# Altium schematic sheet Ideal_Diode_A.SchDoc
size A4; SheetNumber: 6; SheetTotal: 10
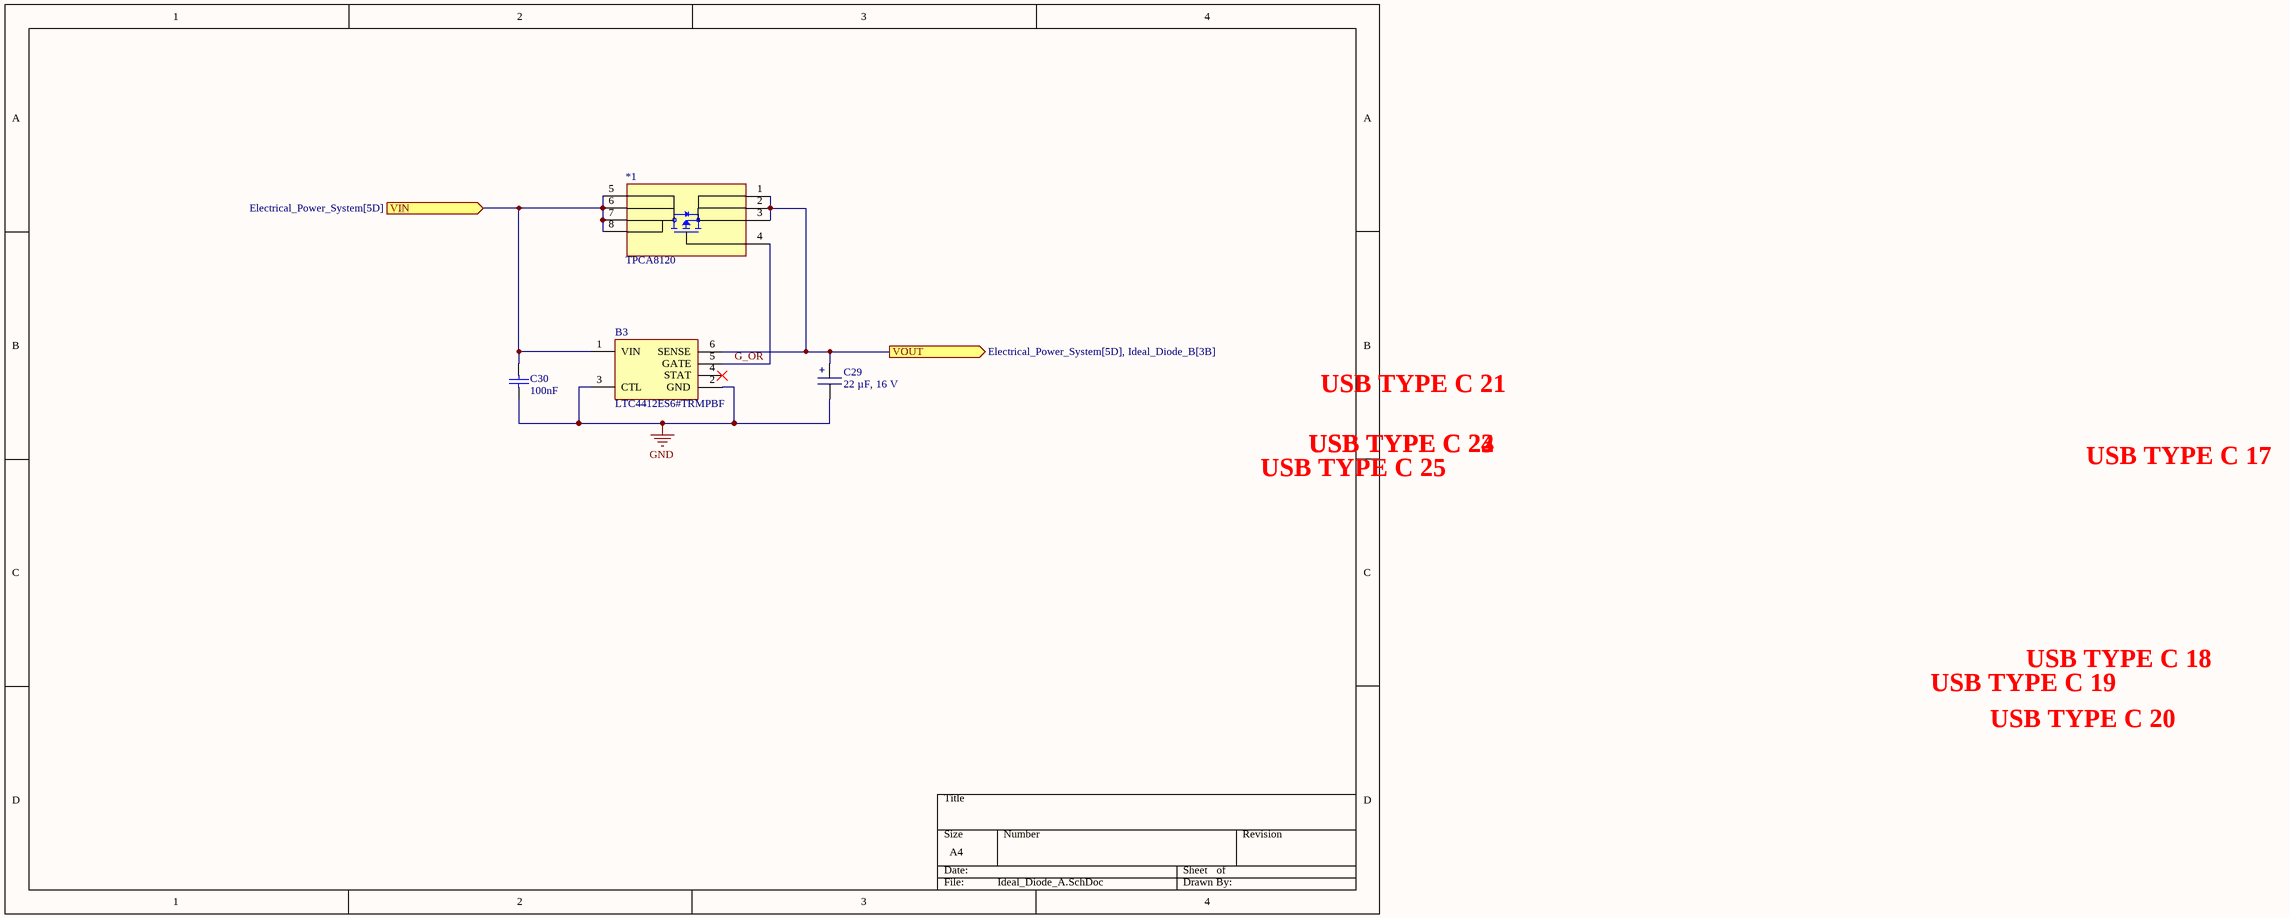
[diagram p0: Ideal_Diode_A.SchDoc]

## Parts
*1  TPCA8120  [TRANS_TPHR8504PL,L1Q]
B3  LTC4412ES6#TRMPBF  [SOT95P280X100-6N]
C29  22 µF, 16 V  [TANTALUM SMD C]
C30  value 100nF  [CAP-SM-0805]  (hidden comment: Cap Non-Pol SMD)

## Ports
VIN (in, see Electrical_Power_System[5D]), VOUT (out, see Electrical_Power_System[5D], Ideal_Diode_B[3B])

## Nets
GND: B3.2(GND) B3.3(CTL) C29.1 C30.1
G_OR: *1.4(G) B3.5(GATE)
VIN: *1.5(D1) *1.6(D2) *1.7(D3) *1.8(D4) B3.1(VIN) C30.2 ; port VIN
VOUT: *1.1(S1) *1.2(S2) *1.3(S3) B3.6(SENSE) C29.2 ; port VOUT

Not connected (* = marked no-connect by the designer): B3 4(STAT)*

## Notes on the sheet
- USB TYPE C 21
- USB TYPE C 22
- USB TYPE C 23
- USB TYPE C 24
- USB TYPE C 25
- USB TYPE C 17
- USB TYPE C 19
- USB TYPE C 18
- USB TYPE C 20
- (in symbol 01231222610) +

## Library data of the parts
B3 = LTC4412ES6: Hot Swap Controller LTC4412ES6#TRMPBF, Positive Voltage, 2.5  28 V, TSOT-23, 6-Pin; Manufacturer_Name: Analog Devices; Geometry.Height: 1mm; Mouser Part Number: 584-LTC4412ES6TRMPBF; Mouser Price/Stock: https://www.mouser.co.uk/ProductDetail/Analog-Devices/LTC4412ES6TRMPBF?qs=hVkxg5c3xu8vBeVp9%252BXk%252Bg%3D%3D; Manufacturer_Part_Number: LTC4412ES6#TRMPBF; Datasheet Link: http://cds.linear.com/docs/en/datasheet/4412fb.pdf
C29 = 01231222610: CAP TANT 22uF 10% 16V 2312; Manufacture  Name: KYOCERA AVX; Manufacture  SN: TAJC226K016RNJ; Capacitance Tolerance: +/-10%; ComponentLink1Description: Datasheet link; ComponentLink1URL: https://datasheets.kyocera-avx.com/TAJ.pdf; ComponentLink2Description: Supplier 1 URL; ComponentLink2URL: https://www.mouser.vn/ProductDetail/KYOCERA-AVX/TAJC226K016RNJ?qs=zt0pNtghXG%252B8PDA37tw3BQ%3D%3D; Size: 2312; Mounting Technology: SMT; Capacitance: 22uF; ComponentLink3Description: Supplier 2 URL; ComponentLink3URL: https://www.digikey.com/en/products/detail/kyocera-avx/TAJC226K016RNJ/1126827; ComponentLink4Description: Supplier 3 URL; ComponentLink4URL: https://www.thegioiic.com/tu-tantalum-22uf-16v-2312-tajc226k016rnj; Supplier 1 Name: Mouser; Supplier 1 SN: 581-TAJC226K016R; Supplier 1 URL: https://www.mouser.vn/ProductDetail/KYOCERA-AVX/TAJC226K016RNJ?qs=zt0pNtghXG%252B8PDA37tw3BQ%3D%3D; Supplier 2 Name: Digi-Key; Supplier 2 SN: 478-3899-1-ND; Supplier 2 URL: https://www.digikey.com/en/products/detail/kyocera-avx/TAJC226K016RNJ/1126827; Supplier 3 Name: thegioiic; Supplier 3 SN: N/A; Supplier 3 URL: https://www.thegioiic.com/tu-tantalum-22uf-16v-2312-tajc226k016rnj; Value: 22 µF, 16 V; Rated Voltage: 16 V
C30 = Cap Non-Pol SMD: Capacitor